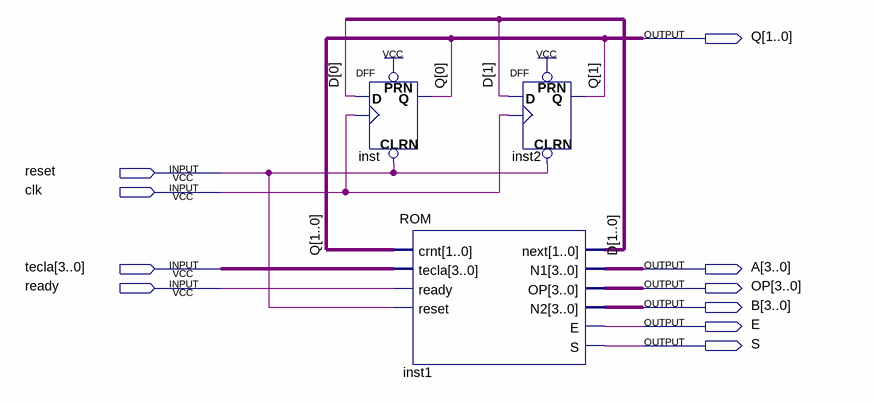
[diagram p0: schematic sheet]
// Quartus schematic maquina.bdf as structural Verilog: 3 symbols, 10 pins
module maquina (
  input  reset,
  input  clk,
  input  [3:0] tecla,
  input  ready,
  output [1:0] Q,
  output [3:0] A,
  output [3:0] OP,
  output [3:0] B,
  output E,
  output S
);

  wire [1:0] D;

  DFF inst (.CLRN(reset), .CLK(clk), .D(D[0]), .PRN(1'b1), .Q(Q[0]));
  ROM inst1 (.crnt(Q), .tecla(tecla), .ready(ready), .reset(reset), .next(D), .N1(A), .OP(OP), .N2(B), .E(E), .S(S));
  DFF inst2 (.CLRN(reset), .CLK(clk), .D(D[1]), .PRN(1'b1), .Q(Q[1]));
endmodule
